# EAGLE schematic LM2596_SMD_0603 (EAGLE 9.6.2)
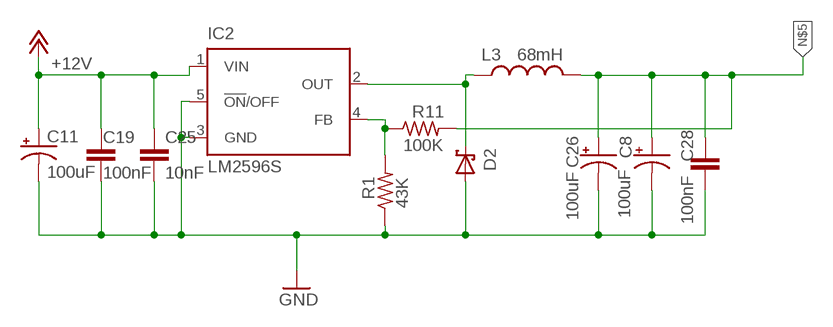
[diagram p0: schematic, sheet 1]

## Parts
C8  100uF  CPOL-USUD-6,3X7,7  [UD-6,3X7,7_NICHICON]
C11  100uF  CPOL-USUD-6,3X7,7  [UD-6,3X7,7_NICHICON]
C19  100nF  C-EUC0603  [C0603]
C25  10nF  C-EUC0603  [C0603]
C26  100uF  CPOL-USUD-6,3X7,7  [UD-6,3X7,7_NICHICON]
C28  100nF  C-EUC0603  [C0603]
D2  SCHOTTKY-DIODEDO41  [DO41-10]
IC2  LM2596S  [TO263-5]
L3  68mH  L-USL0603  [L0603]
R1  43K  R-US_R0603  [R0603]
R11  100K  R-US_R0603  [R0603]

## Nets
+12V: C11.+ C19.1 C25.1 IC2.1(VIN)
GND: C8.- C11.- C19.2 C25.2 C26.- C28.2 D2.A IC2.3(GND) IC2.5(!ON!/OFF) R1.1
N$5: C8.+ C26.+ C28.1 L3.2 R11.2
N$6: D2.C IC2.2(OUT) L3.1
N$7: IC2.4(FB) R1.2 R11.1

## Library data of the parts
C8 C11 C26 = rcl:CPOL-US: POLARIZED CAPACITOR, American symbol; SPICEPREFIX: C
C19 C25 C28 = rcl:C-EU: CAPACITOR, European symbol; SPICEPREFIX: C
D2 = adafruit:SCHOTTKY-DIODE: Schottky Diode
IC2 = national-semiconductor:LM2596: SIMPLE SWITCHER® Power Converter 150 kHz 3A Step-Down Voltage Regulator Source: http://www.national.com/ds/LM/LM2596.pdf; MF: NATIONAL SEMICONDUCTOR; MPN: LM2596S-ADJ/NOPB; OC_FARNELL: 9494367; OC_NEWARK: 41K3842
L3 = rcl-2:L-US: INDUCTOR, American symbol
R1 R11 = adafruit:R-US_: RESISTOR, American symbol